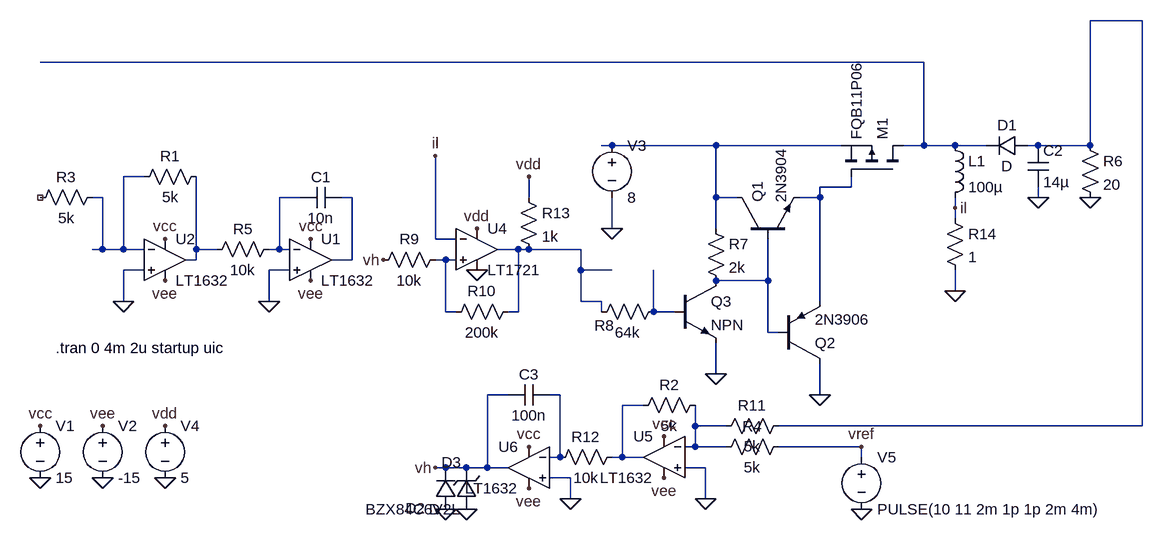
[diagram p0: schematic buck-boost-scm.asc]
buck-boost-scm.asc, the LTspice schematic file:
Version 4
SHEET 1 1716 796
WIRE 1184 -368 1104 -368
WIRE 848 -304 -512 -304
WIRE 368 -176 352 -176
WIRE 528 -176 368 -176
WIRE 720 -176 528 -176
WIRE 848 -176 848 -304
WIRE 848 -176 816 -176
WIRE 896 -176 848 -176
WIRE 944 -176 896 -176
WIRE 1024 -176 1008 -176
WIRE 1104 -176 1104 -368
WIRE 1104 -176 1024 -176
WIRE -352 -128 -384 -128
WIRE 736 -112 736 -128
WIRE 736 -112 688 -112
WIRE -416 -96 -432 -96
WIRE -112 -96 -144 -96
WIRE -32 -96 -48 -96
WIRE 240 -96 240 -128
WIRE 528 -96 528 -176
WIRE 560 -96 528 -96
WIRE 688 -96 688 -112
WIRE 688 -96 656 -96
WIRE 1024 -96 1024 -112
WIRE 896 -80 896 -96
WIRE 896 -64 896 -80
WIRE 368 -48 368 -96
WIRE 528 -48 528 -96
WIRE 96 -32 96 -160
WIRE 128 -32 96 -32
WIRE -416 -16 -416 -96
WIRE -416 -16 -432 -16
WIRE -384 -16 -384 -128
WIRE -384 -16 -416 -16
WIRE -352 -16 -384 -16
WIRE -272 -16 -272 -128
WIRE -240 -16 -272 -16
WIRE -144 -16 -144 -96
WIRE -144 -16 -160 -16
WIRE -128 -16 -144 -16
WIRE 224 -16 192 -16
WIRE 240 -16 224 -16
WIRE 320 -16 240 -16
WIRE -272 0 -272 -16
WIRE -272 0 -288 0
WIRE -32 0 -32 -96
WIRE -32 0 -64 0
WIRE 112 0 96 0
WIRE 128 0 112 0
WIRE -352 16 -384 16
WIRE -128 16 -160 16
WIRE 320 16 320 -16
WIRE 368 16 320 16
WIRE 608 32 608 -32
WIRE 608 32 528 32
WIRE 896 48 896 16
WIRE -384 64 -384 16
WIRE -160 64 -160 16
WIRE 320 64 320 16
WIRE 352 64 320 64
WIRE 688 64 688 -96
WIRE 112 80 112 0
WIRE 128 80 112 80
WIRE 224 80 224 -16
WIRE 224 80 208 80
WIRE 352 80 352 64
WIRE 432 80 432 16
WIRE 464 80 432 80
WIRE 608 112 608 32
WIRE 624 112 608 112
WIRE 528 176 528 128
WIRE 208 208 176 208
WIRE 288 208 272 208
WIRE 688 208 688 160
WIRE 416 224 384 224
WIRE 496 256 496 224
WIRE 544 256 496 256
WIRE 1184 256 1184 -368
WIRE 1184 256 624 256
WIRE 496 288 496 256
WIRE 496 288 480 288
WIRE 544 288 496 288
WIRE 752 288 624 288
WIRE 288 304 288 208
WIRE 288 304 272 304
WIRE 384 304 384 224
WIRE 384 304 368 304
WIRE 416 304 384 304
WIRE 752 304 752 288
WIRE 112 320 96 320
WIRE 144 320 112 320
WIRE 176 320 176 208
WIRE 176 320 144 320
WIRE 208 320 176 320
WIRE 512 320 480 320
WIRE 304 336 272 336
WIRE 304 368 304 336
WIRE 512 368 512 320
FLAG -96 -32 vcc
FLAG -320 -32 vcc
FLAG -416 336 0
FLAG -512 336 0
FLAG -512 256 vcc
FLAG -416 256 vee
FLAG -96 32 vee
FLAG -320 32 vee
FLAG -160 64 0
FLAG 896 48 0
FLAG 1024 -96 0
FLAG 1104 -96 0
FLAG 368 -48 0
FLAG 688 208 0
FLAG 528 176 0
FLAG 160 16 0
FLAG -320 336 0
FLAG -320 256 vdd
FLAG 160 -48 vdd
FLAG 16 0 vh
FLAG 240 -128 vdd
FLAG -384 64 0
FLAG 240 352 vee
FLAG 448 336 vee
FLAG 304 368 0
FLAG 512 368 0
FLAG 240 288 vcc
FLAG 448 272 vcc
FLAG 752 384 0
FLAG 752 288 vref
FLAG 96 320 vh
FLAG 112 384 0
FLAG 896 -80 il
FLAG 96 -160 il
FLAG 144 384 0
SYMBOL Opamps\\LT1632 -96 -64 R0
SYMATTR InstName U1
SYMBOL Opamps\\LT1632 -320 -64 R0
SYMATTR InstName U2
SYMBOL voltage -512 240 R0
WINDOW 123 0 0 Left 0
WINDOW 39 0 0 Left 0
SYMATTR InstName V1
SYMATTR Value 15
SYMBOL voltage -416 240 R0
WINDOW 123 0 0 Left 0
WINDOW 39 0 0 Left 0
SYMATTR InstName V2
SYMATTR Value -15
SYMBOL res -256 -144 R90
WINDOW 0 0 56 VBottom 0
WINDOW 3 32 56 VTop 0
SYMATTR InstName R1
SYMATTR Value 5k
SYMBOL res -144 -32 R90
WINDOW 0 0 56 VBottom 0
WINDOW 3 32 56 VTop 0
SYMATTR InstName R5
SYMATTR Value 10k
SYMBOL cap -48 -112 R90
WINDOW 0 0 32 VBottom 0
WINDOW 3 32 32 VTop 0
SYMATTR InstName C1
SYMATTR Value 10n
SYMBOL ind 880 -192 R0
SYMATTR InstName L1
SYMATTR Value 100µ
SYMBOL res 1088 -192 R0
SYMATTR InstName R6
SYMATTR Value 20
SYMBOL cap 1008 -176 R0
SYMATTR InstName C2
SYMATTR Value 14µ
SYMBOL voltage 368 -192 R0
WINDOW 123 0 0 Left 0
WINDOW 39 0 0 Left 0
SYMATTR InstName V3
SYMATTR Value 8
SYMBOL pmos 816 -128 M270
SYMATTR InstName M1
SYMATTR Value FQB11P06
SYMBOL diode 1008 -192 R90
WINDOW 0 0 32 VBottom 0
WINDOW 3 32 32 VTop 0
SYMATTR InstName D1
SYMBOL npn 560 -32 R270
SYMATTR InstName Q1
SYMATTR Value 2N3904
SYMBOL pnp 624 160 M180
SYMATTR InstName Q2
SYMATTR Value 2N3906
SYMBOL Comparators\\LT1721 160 -80 R0
SYMATTR InstName U4
SYMBOL npn 464 32 R0
SYMATTR InstName Q3
SYMBOL res 512 -64 R0
SYMATTR InstName R7
SYMATTR Value 2k
SYMBOL res 448 64 R90
WINDOW 0 53 92 VBottom 0
WINDOW 3 32 56 VTop 0
SYMATTR InstName R8
SYMATTR Value 64k
SYMBOL voltage -320 240 R0
WINDOW 123 0 0 Left 0
WINDOW 39 0 0 Left 0
SYMATTR InstName V4
SYMATTR Value 5
SYMBOL res -416 -112 R90
WINDOW 0 0 56 VBottom 0
WINDOW 3 32 56 VTop 0
SYMATTR InstName R3
SYMATTR Value 5k
SYMBOL Opamps\\LT1632 448 240 M0
SYMATTR InstName U5
SYMBOL Opamps\\LT1632 240 256 M0
SYMATTR InstName U6
SYMBOL res 512 208 R90
WINDOW 0 0 56 VBottom 0
WINDOW 3 32 56 VTop 0
SYMATTR InstName R2
SYMATTR Value 5k
SYMBOL res 640 272 R90
WINDOW 0 0 56 VBottom 0
WINDOW 3 32 56 VTop 0
SYMATTR InstName R4
SYMATTR Value 5k
SYMBOL res 640 240 R90
WINDOW 0 0 56 VBottom 0
WINDOW 3 32 56 VTop 0
SYMATTR InstName R11
SYMATTR Value 5k
SYMBOL voltage 752 288 R0
WINDOW 123 0 0 Left 0
WINDOW 39 0 0 Left 0
SYMATTR InstName V5
SYMATTR Value PULSE(10 11 2m 1p 1p 2m 4m)
SYMBOL cap 272 192 R90
WINDOW 0 0 32 VBottom 0
WINDOW 3 32 32 VTop 0
SYMATTR InstName C3
SYMATTR Value 100n
SYMBOL res 384 288 R90
WINDOW 0 0 56 VBottom 0
WINDOW 3 32 56 VTop 0
SYMATTR InstName R12
SYMATTR Value 10k
SYMBOL res 112 -16 R90
WINDOW 0 0 56 VBottom 0
WINDOW 3 32 56 VTop 0
SYMATTR InstName R9
SYMATTR Value 10k
SYMBOL res 224 64 R90
WINDOW 0 0 56 VBottom 0
WINDOW 3 32 56 VTop 0
SYMATTR InstName R10
SYMATTR Value 200k
SYMBOL res 224 -112 R0
SYMATTR InstName R13
SYMATTR Value 1k
SYMBOL diode 128 384 R180
WINDOW 0 47 1 Left 0
WINDOW 3 24 0 Left 0
SYMATTR InstName D2
SYMBOL res 880 -80 R0
SYMATTR InstName R14
SYMATTR Value 1
SYMBOL zener 160 384 R180
WINDOW 0 24 72 Left 0
WINDOW 3 24 0 Left 0
SYMATTR InstName D3
SYMATTR Value BZX84C6V2L
SYMATTR Description Diode
SYMATTR Type diode
TEXT -488 136 Left 0 !.tran 0 4m 2u startup uic

The netlist it stands for:
* buck-boost-scm.asc
XU1 0 N006 vcc vee N007 LT1632  ; pins In+ In- V+ V- OUT
XU2 0 N004 vcc vee N008 LT1632  ; pins In+ In- V+ V- OUT
V1 vcc 0 15
V2 vee 0 -15
R1 N008 N004 5k
R5 N006 N008 10k
C1 N007 N006 10n
L1 N002 il 100µ
R6 N001 0 20
C2 N001 0 14µ
V3 N003 0 8
M1 N002 N005 N003 N003 FQB11P06
D1 N001 N002 D
Q1 N003 N011 N005 0 2N3904
Q2 0 N011 N005 0 2N3906
XU4 N010 il vdd 0 N009 LT1720  ; LT1721, pins In+ In- V+ V- OUT
Q3 N011 N012 0 0 NPN
R7 N003 N011 2k
R8 N012 N009 64k
V4 vdd 0 5
R3 N004 NC_01 5k
XU5 0 N015 vcc vee N014 LT1632  ; pins In+ In- V+ V- OUT
XU6 0 N013 vcc vee vh LT1632  ; pins In+ In- V+ V- OUT
R2 N015 N014 5k
R4 vref N015 5k
R11 N001 N015 5k
V5 vref 0 PULSE(10 11 2m 1p 1p 2m 4m)
C3 N013 vh 100n
R12 N014 N013 10k
R9 N010 vh 10k
R10 N009 N010 200k
R13 vdd N009 1k
D2 0 vh D
R14 il 0 1
D3 0 vh BZX84C6V2L
.model D D
.lib standard.dio
.model NPN NPN
.model PNP PNP
.lib standard.bjt
.model NMOS NMOS
.model PMOS PMOS
.lib standard.mos
.tran 0 4m 2u startup uic
.lib LTC.lib
.backanno
.end